# Altium schematic sheet Sheet_1-copy-copy_2026-03-31.schdoc
size 606 x 430 mm
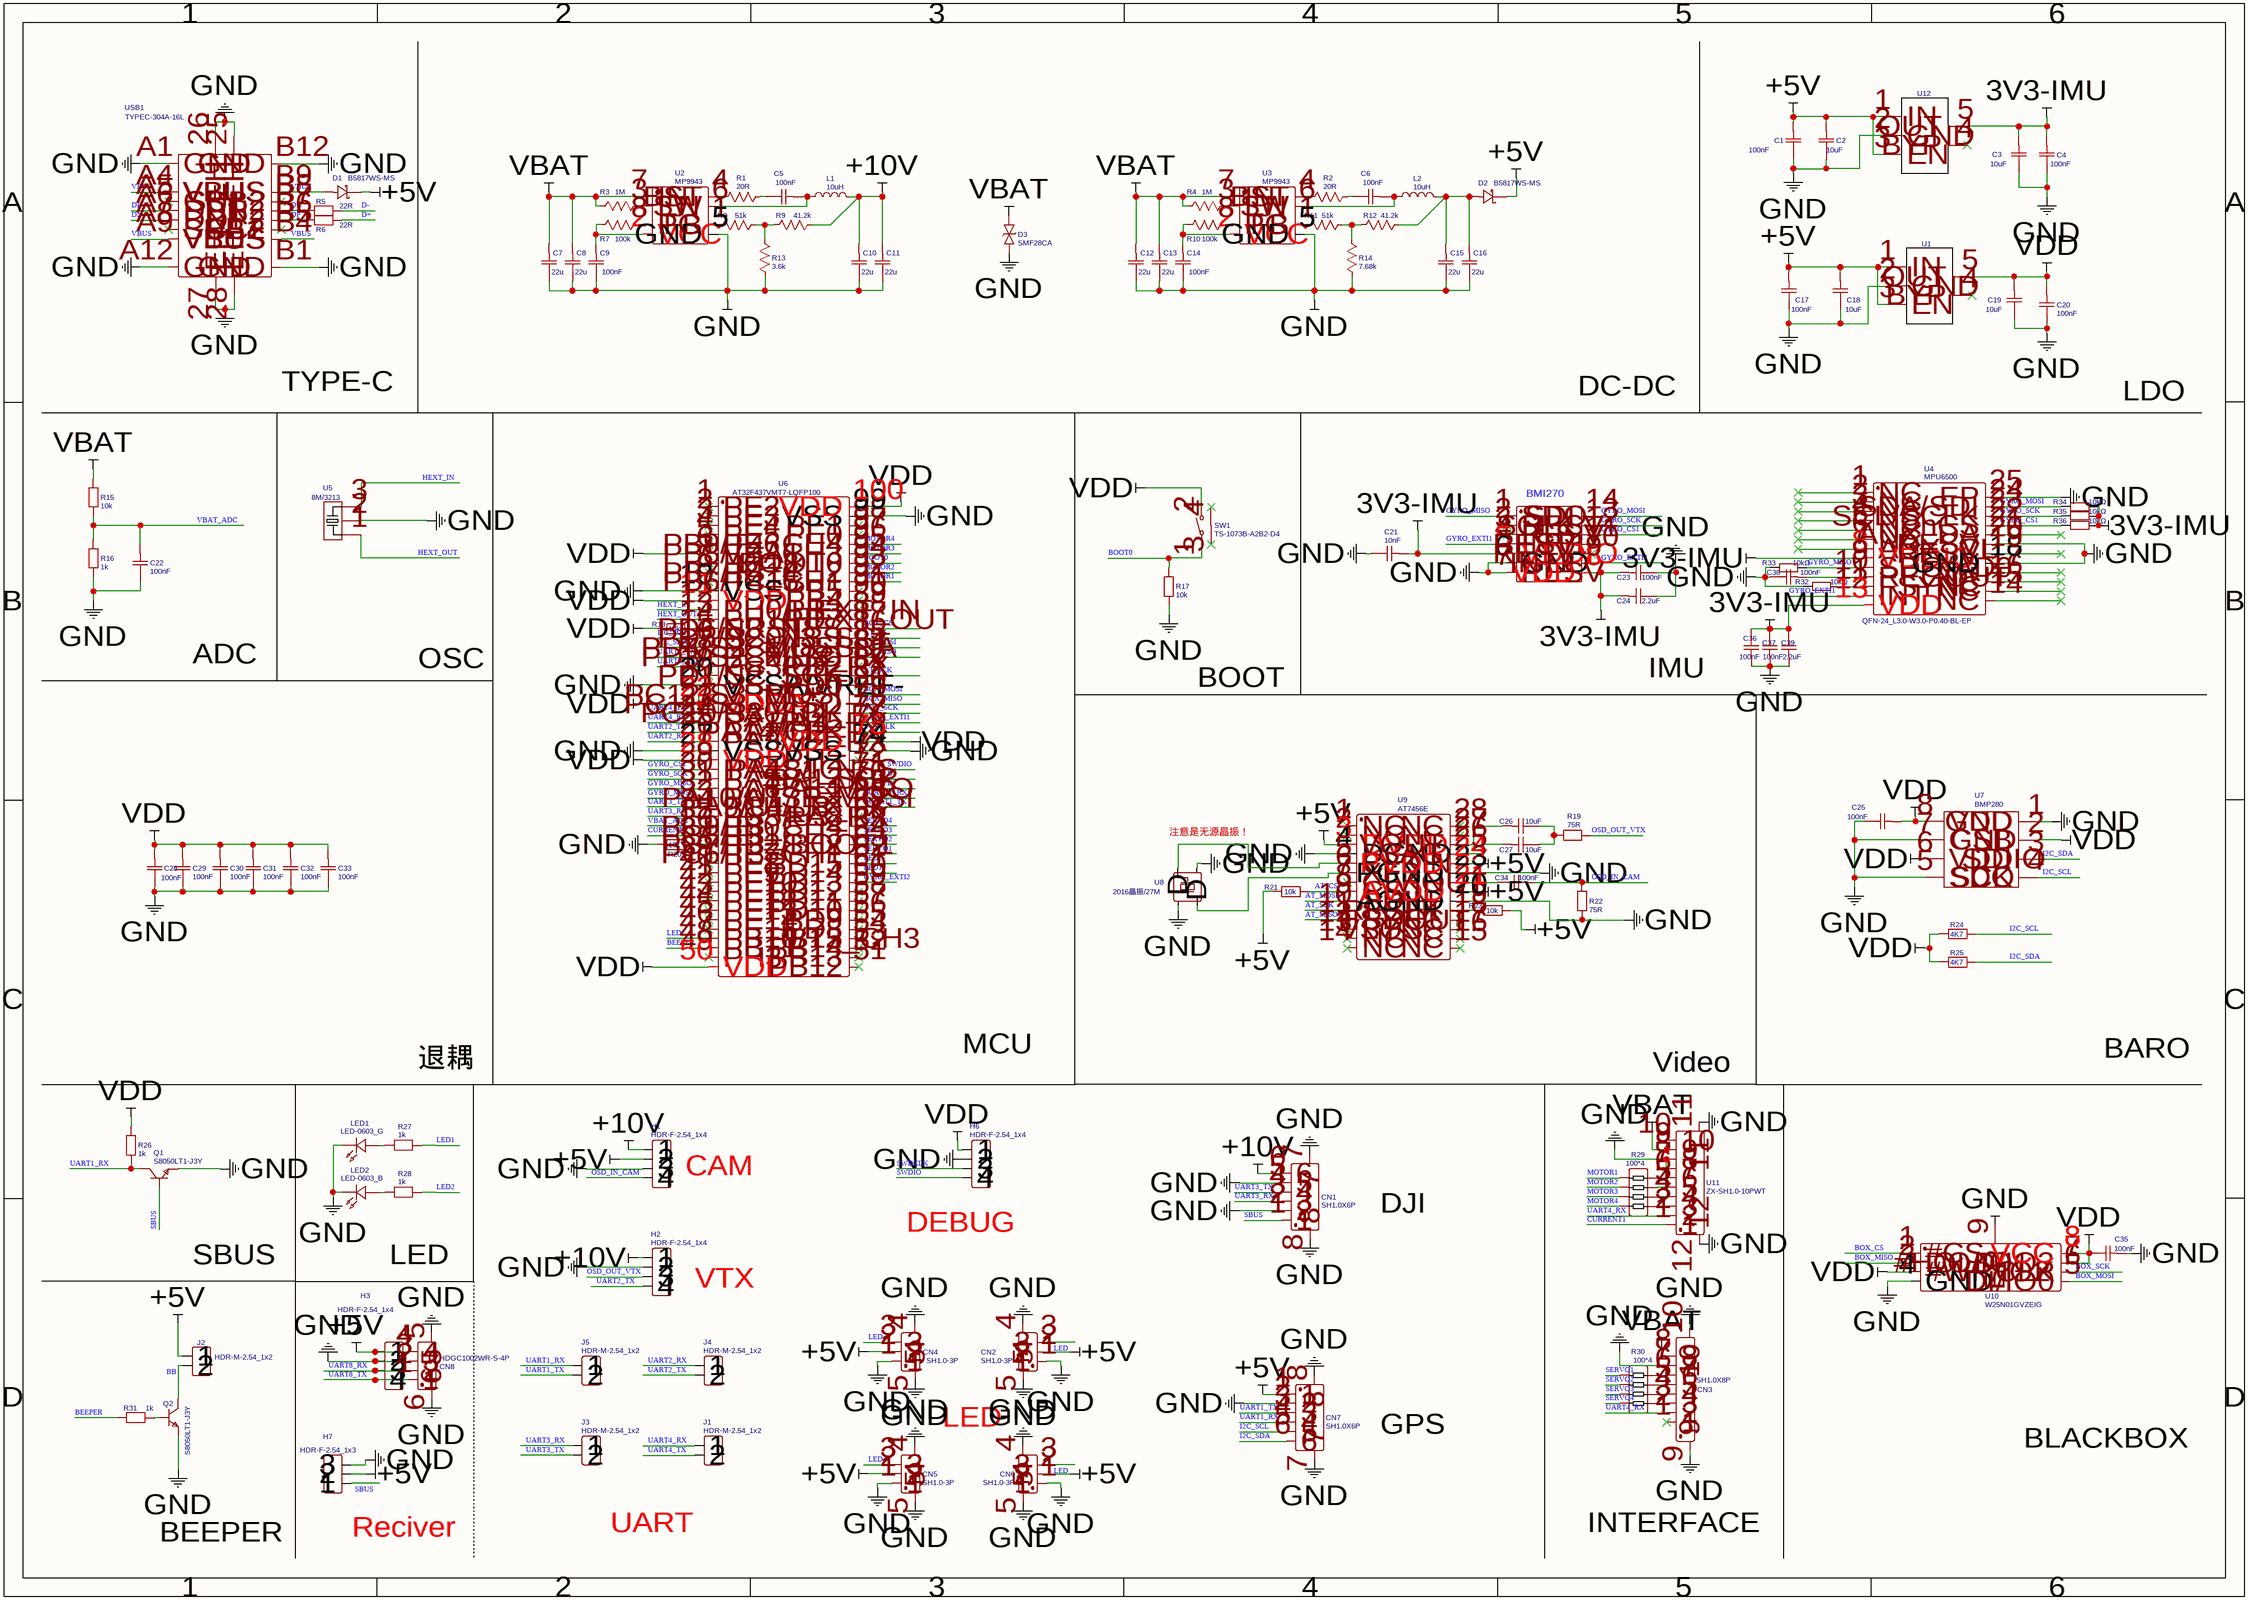
[diagram p0: Sheet_1-copy-copy_2026-03-31.schdoc]

## Parts
C1  100nF  [C0603]
C2  10uF  [C0603]
C3  10uF  [C0603]
C4  100nF  [C0603]
C5  100nF  [C0603]
C6  100nF  [C0603]
C7  22u  [C0805]
C8  22u  [C0805]
C9  100nF  [C0603]
C10  22u  [C0805]
C11  22u  [C0805]
C12  22u  [C0805]
C13  22u  [C0805]
C14  100nF  [C0603]
C15  22u  [C0805]
C16  22u  [C0805]
C17  100nF  [C0603]
C18  10uF  [C0603]
C19  10uF  [C0603]
C20  100nF  [C0603]
C21  10nF  [C0603]
C22  100nF  [C0603]
C23  100nF  [C0603]
C24  2.2uF  [C0603]
C25  100nF  [C0603]
C26  10uF  [C0603]
C27  10uF  [C0603]
C28  100nF  [C0603]
C29  100nF  [C0603]
C30  100nF  [C0603]
C31  100nF  [C0603]
C32  100nF  [C0603]
C33  100nF  [C0603]
C34  100nF  [C0603]
C35  100nF  [C0603]
C36  100nF  [C0603]
C37  100nF  [C0603]
C38  100nF  [C0603]
C39  2.2uF  [C0603]
CN1  SH1.0X6P  [CONN-SMD_6P-P1.00_MEGASTAR_ZX-SH1.0-6PWT]
CN2  SH1.0-3P  [CONN-SMD_3P-P1.00_HDGC_HDGC1002WR-S-3P]
CN3  SH1.0X8P  [CONN-SMD_8P-P1.00_WAFER-SH1.0-8PWB]
CN4  SH1.0-3P  [CONN-SMD_3P-P1.00_HDGC_HDGC1002WR-S-3P]
CN5  SH1.0-3P  [CONN-SMD_3P-P1.00_HDGC_HDGC1002WR-S-3P]
CN6  SH1.0-3P  [CONN-SMD_3P-P1.00_HDGC_HDGC1002WR-S-3P]
CN7  SH1.0X6P  [CONN-SMD_6P-P1.00_MEGASTAR_ZX-SH1.0-6PWT]
CN8  HDGC1002WR-S-4P  [CONN-SMD_4P-P1.00_HDGC_HDGC1002WR-S-4P]
D1  B5817WS-MS  [SOD-323_L1.7-W1.3-LS2.7-FD]
D2  B5817WS-MS  [SOD-323_L1.7-W1.3-LS2.7-FD]
D3  SMF28CA  [SOD-123_L2.7-W1.8-LS3.7-BI]
H1  HDR-F-2.54_1x4  [HDR-F-2.54_1X4]
H2  HDR-F-2.54_1x4  [HDR-F-2.54_1X4]
H3  HDR-F-2.54_1x4  [HDR-F-2.54_1X4]
H6  HDR-F-2.54_1x4  [HDR-F-2.54_1X4]
H7  HDR-F-2.54_1x3  [HDR-F-2.54_1X3]
J1  HDR-M-2.54_1x2  [HDR-M-2.54_1X2]
J2  HDR-M-2.54_1x2  [HDR-M-2.54_1X2]
J3  HDR-M-2.54_1x2  [HDR-M-2.54_1X2]
J4  HDR-M-2.54_1x2  [HDR-M-2.54_1X2]
J5  HDR-M-2.54_1x2  [HDR-M-2.54_1X2]
L1  10uH  [IND-SMD_L4.4-W4.0_PHC0420]
L2  10uH  [IND-SMD_L4.4-W4.0_PHC0420]
LED1  LED-0603_G  [LED0603_GREEN]
LED2  LED-0603_B  [LED0603_BLUE]
Q1  S8050LT1-J3Y  [SOT-23_L2.9-W1.3-P1.90-LS2.4-BR]
Q2  S8050LT1-J3Y  [SOT-23_L2.9-W1.3-P1.90-LS2.4-BR]
R1  20R  [R0603]
R2  20R  [R0603]
R3  1M  [R0603]
R4  1M  [R0603]
R5  22R  [R0603]
R6  22R  [R0603]
R7  100k  [R0603]
R8  51k  [R0603]
R9  41.2k  [R0603]
R10  100k  [R0603]
R11  51k  [R0603]
R12  41.2k  [R0603]
R13  3.6k  [R0603]
R14  7.68k  [R0603]
R15  10k  [R0603]
R16  1k  [R0603]
R17  10k  [R0603]
R18  10k  [R0603]
R19  75R  [R0603]
R20  10k  [R0603]
R21  10k  [R0603]
R22  75R  [R0603]
R23  10k  [R0603]
R24  4K7  [R0603]
R25  4K7  [R0603]
R26  1k  [R0603]
R27  1k  [R0603]
R28  1k  [R0603]
R29  100*4  [RES-ARRAY-SMD_0402-8P-L2.0-W1.0-BL]
R30  100*4  [RES-ARRAY-SMD_0402-8P-L2.0-W1.0-BL]
R31  1k  [R0603]
R32  10kΩ  [R0402]
R33  10kΩ  [R0402]
R34  10kΩ  [R0402]
R35  10kΩ  [R0402]
R36  10kΩ  [R0402]
SDO1  BMI270  [LGA-14_L3.0-W2.5-P0.50-TL]  (value not drawn)
SW1  TS-1073B-A2B2-D4  [KEY-SMD_TS-1073B-A2B2-D4]
U1  SPX3819M5-L-3-3/TR  [SOT-23-5_L3.0-W1.7-P0.95-LS2.8-BL]  (value not drawn)
U2  MP9943  [QFN-8-3X3]
U3  MP9943  [QFN-8-3X3]
U4  MPU6500  [QFN-24_L3.0-W3.0-P0.40-BL-EP]
U5  8M/3213  [X3213]
U6  AT32F437VMT7-LQFP100  [LQFP-100_L14.0-W14.0-P0.50-LS16.0-TL]
U7  BMP280  [SENSOR-TH_BMP280-BL]
U8  2016晶振/27M  [2016晶振]
U9  AT7456E  [TSSOP-28_L9.7-W4.4-P0.65-LS6.4-BL-EP5.5]
U10  W25N01GVZEIG  [WSON-8_L8.0-W6.10-P1.27-EP]
U11  ZX-SH1.0-10PWT  [CONN-SMD_10P-P1.00_ZX-SH1.0-10PWT]
U12  SPX3819M5-L-3-3/TR  [SOT-23-5_L3.0-W1.7-P0.95-LS2.8-BL]  (value not drawn)
USB1  TYPEC-304A-16L  [USB-C-SMD_XUNPU_TYPEC-304A-ACP16L]

## Nets
3V3-IMU: C3.2 C4.2 C21.2 C23.2 C24.2 C36.1 C37.1 C39.1 R34.2 R35.2 R36.2 SDO1.5(VDDIO) SDO1.8(VDD) U4.8(VDDIO) U4.13(VDD) U12.5(OUT)
+5V: C1.2 C2.2 C17.2 C18.2 CN2.2 CN4.2 CN5.2 CN6.2 CN7.1 CN8.4 D1.2(K) D2.2(K) H1.2 H3.1 H7.2 J2.1 R21.1 R23.2 U1.1(IN) U1.3(EN) U9.3(DVDD) U9.21(AVDD) U9.24(PVDD) U12.1(IN) U12.3(EN)
+10V: C10.2 C11.2 CN1.6 H1.1 H2.1 L1.2 R9.2
GND: C1.1 C2.1 C3.1 C4.1 C7.1 C8.1 C9.1 C10.1 C11.1 C12.1 C13.1 C14.1 C15.1 C16.1 C17.1 C18.1 C19.1 C20.1 C21.1 C22.1 C23.1 C24.1 C25.1 C28.1 C29.1 C30.1 C31.1 C32.1 C33.1 C35.2 C36.2 C37.2 C38.1 C39.2 CN1.2 CN1.5 CN1.7 CN1.8 CN2.1 CN2.4 CN2.5 CN3.7 CN3.9 CN3.10 CN4.1 CN4.4 CN4.5 CN5.1 CN5.4 CN5.5 CN6.1 CN6.4 CN6.5 CN7.2 CN7.7 CN7.8 CN8.3 CN8.5 CN8.6 D3.2 H1.3 H2.2 H3.2 H6.2 H7.3 LED1.2 LED2.2 Q1.2 Q2.2 R13.1 R14.1 R16.1 R17.2 R20.1 R22.1 R32.1 R33.1 SDO1.6(GND) SDO1.7(RESV) U1.2(GND) U2.5(GND) U3.5(GND) U4.18(GND) U4.20(RESV) U4.25(EP) U5.2 U6.10(VSS) U6.20(VSSA/VREF-) U6.27(VSS) U6.74(VSS) U6.99(VSS) U7.1(GND) U7.5(SDO) U7.7(GND) U8.2(D) U8.4(D) U9.4(DGND) U9.20(AGND) U9.23(PGND) U10.4(GND) U10.9(EP) U11.7 U11.8 U11.11 U11.12 U12.2(GND) USB1.25(EH) USB1.26(EH) USB1.27(EH) USB1.28(EH) USB1.A1(GND) USB1.A12(GND) USB1.B1(GND) USB1.B12(GND)
VBAT: C7.2 C8.2 C12.2 C13.2 CN3.8 D3.1 R3.2 R4.2 R15.2 U2.7(IN) U3.7(IN) U11.9 U11.10
VDD: C19.2 C20.2 C25.2 C28.2 C29.2 C30.2 C31.2 C32.2 C33.2 C35.1 H6.1 R18.2 R24.2 R25.2 R26.2 SW1.2 U1.5(OUT) U6.6(VBAT) U6.11(VDD) U6.21(VREF+) U6.22(VDDA) U6.28(VDD) U6.50(VDD) U6.75(VDD) U6.100(VDD) U7.2(CSB) U7.6(VDDIO) U7.8(VDD) U10.3(#WP/IO2) U10.7(#HOLD/IO3) U10.8(VCC)
AT_CS: R21.2 U6.86(PD5/S2_NSS) U9.8(CS)
AT_MISO: U6.84(PD3/S2_MISO) U9.11(SDOUT)
AT_MOSI: U6.85(PD4/S2_MOSI) U9.9(SDIN)
AT_SCK: U6.82(PD1/S2_SCK) U9.10(SCLK)
BB: J2.2 Q2.3
BEEPER: R31.1 U6.48(PB11)
BOOT0: R17.1 SW1.1 U6.94(BOOT0)
BOX_CS: U6.87(PD6/S3_NSS) U10.1(#CS)
BOX_MISO: U6.79(PC11/S3_MISO) U10.2(DO/IO1)
BOX_MOSI: U6.80(PC12/S3_MOSI) U10.5(DI/IO0)
BOX_SCK: U6.78(PC10/S3_SCK) U10.6(CLK)
CURRENT1: U6.36(PB1) U11.1
D+: R6.2 U6.71(PA12)
D-: R5.2 U6.70(PA11)
DN: R5.1 USB1.A7(DN1) USB1.B7(DN2)
DP: R6.1 USB1.A6(DP1) USB1.B6(DP2)
GYRO_CS1: R36.1 SDO1.12(CS) U4.22(nCS) U6.29(PA~{4}S1_NSS)
GYRO_EXTI1: SDO1.4(INT1) U4.12(INT) U6.77(PA15)
GYRO_EXTI2: SDO1.9(INT2) U6.60(PD13)
GYRO_MISO: R33.2 SDO1.1(SDO) U4.9(SDO/AD0) U6.31(PA~{6}S1_MISO)
GYRO_MOSI: R34.1 SDO1.14(SDI) U4.24(SDA/SDI) U6.32(PA~{7}S1_MOSI)
GYRO_SCK: R35.1 SDO1.13(SCLK) U4.23(SCL/SCLK) U6.30(PA~{5}S1_SCK)
HEXT_IN: U5.3 U6.12(PH0/HEXT_IN)
HEXT_OUT: U5.1 U6.13(PH1/HEXT_OUT)
I2C_SCL: CN7.5 R24.1 U6.15(PC0/I3_SCL) U7.4(SCK)
I2C_SDA: CN7.6 R25.1 U6.16(PC1/I3_SDA) U7.3(SDI)
LED: CN2.3 CN4.3 CN5.3 CN6.3 U6.47(PB10/T2_CH3)
LED1: R27.2 U6.61(PD14)
LED2: R28.2 U6.62(PD15)
MOTOR1: R29.4 U6.92(PB6/T4_CH1)
MOTOR2: R29.3 U6.93(PB7/T4_CH2)
MOTOR3: R29.2 U6.95(PB8/T4_CH3)
MOTOR4: R29.1 U6.96(PB9/T4_CH4)
OSD_IN_CAM: C34.2 H1.4 R22.2
OSD_OUT_VTX: H2.3 R19.2
SBUS: CN1.1 H7.1 Q1.1
SERVO1: R30.4 U6.63(PC6/T3_CH1)
SERVO2: R30.3 U6.64(PC7/T3_CH2)
SERVO3: R30.2 U6.65(PC8/T3_CH3)
SERVO4: R30.1 U6.66(PC9/T3_CH4)
SWDCLK: H6.3 U6.76(PA14/CLK)
SWDIO: H6.4 U6.72(PA13/IO)
UART1_RX: CN7.4 J5.1 Q1.3 R26.1 U6.69(PA10/U1_RX)
UART1_TX: CN7.3 J5.2 U6.68(PA9/U1_TX)
UART2_RX: J4.1 U6.26(PA3/U2_RX)
UART2_TX: H2.4 J4.2 U6.25(PA2/U2_TX)
UART3_RX: CN1.3 J3.1 U6.34(PC5/U3_RX)
UART3_TX: CN1.4 J3.2 U6.33(PC4/U3_TX)
UART4_RX: CN3.2 J1.1 U6.24(PA1/U4_RX) U11.2
UART4_TX: J1.2 U6.23(PA0/U4_TX)
UART8_RX: CN8.2 H3.3 U6.18(PC3/U8_RX)
UART8_TX: CN8.1 H3.4 U6.17(PC2/U8_TX)
VBAT_ADC: C22.2 R15.1 R16.2 U6.35(PB0)
VBUS: D1.1(A) USB1.A4(VBUS) USB1.A9(VBUS) USB1.B4(VBUS) USB1.B9(VBUS)
NetC5_1: C5.1 R1.2
NetC5_2: C5.2 L1.1 U2.6(SW)
NetC6_1: C6.1 R2.2
NetC6_2: C6.2 L2.1 U3.6(SW)
NetC9_2: C9.2 R7.1 U2.2(VCC)
NetC14_2: C14.2 R10.1 U3.2(VCC)
NetC15_2: C15.2 C16.2 D2.1(A) L2.2 R12.2
NetC26_1: C26.1 C27.1 R19.1
NetC26_2: C26.2 U9.26(VOUT)
NetC27_2: C27.2 U9.25(SAG)
NetC34_1: C34.1 U9.22(VIN)
NetC38_2: C38.2 U4.10(REGOUT)
NetCN3_3: CN3.3 R30.8
NetCN3_4: CN3.4 R30.7
NetCN3_5: CN3.5 R30.6
NetCN3_6: CN3.6 R30.5
NetLED1_1: LED1.1 R27.1
NetLED2_1: LED2.1 R28.1
NetQ2_1: Q2.1 R31.2
NetR1_1: R1.1 U2.4(BST)
NetR2_1: R2.1 U3.4(BST)
NetR3_1: R3.1 U2.3(EN)
NetR4_1: R4.1 U3.3(EN)
NetR7_2: R7.2 U2.8(PG)
NetR8_1: R8.1 U2.1(FB)
NetR8_2: R8.2 R9.1 R13.2
NetR10_2: R10.2 U3.8(PG)
NetR11_1: R11.1 U3.1(FB)
NetR11_2: R11.2 R12.1 R14.2
NetR18_1: R18.1 U6.14(NRST)
NetR20_2: R20.2 U6.37(PB2/BOOT1)
NetR23_1: R23.1 U9.19(RESET)
NetR29_5: R29.5 U11.6
NetR29_6: R29.6 U11.5
NetR29_7: R29.7 U11.4
NetR29_8: R29.8 U11.3
NetR32_2: R32.2 U4.11(FSYNC)
NetU8_1: U8.1(OSC1) U9.5(CLKIN)
NetU8_3: U8.3(OSC2) U9.6(XFB)

Not connected (* = marked no-connect by the designer): CN3 1*; SDO1 2(RESV)* 3(RESV)* 10(RESV)* 11(RESV)*; SW1 3* 4*; U1 4(BYP)*; U4 1(NC)* 2(NC)* 3(NC)* 4(NC)* 5(NC)* 6(NC)* 7(AUX_CL)* 14(NC)* 15(NC)* 16(NC)* 17(NC)* 19(RESV)* 21(AUX_DA)*; U6 1(PE2)* 2(PE3)* 3(PE4)* 4(PE5)* 5(PE6)* 7(PC13)* 8(PC14)* 9(PC15)* 19(NC)* 38(PE7)* 39(PE8)* 40(PE9)* 41(PE10)* 42(PE11)* 43(PE12)* 44(PE13)* 45(PE14)* 46(PE15)* 49(PH3)* 51(PB12)* 52(PB13)* 53(PB14)* 54(PB15)* 55(PD8)* 56(PD9)* 57(PD10)* 58(PD11)* 59(PD12)* 67(PA8)* 73(PH2)* 81(PD0)* 83(PD2)* 88(PD7)* 89(PB3)* 90(PB4)* 91(PB5)* 97(PE0)* 98(PE1)*; U9 1(NC)* 2(NC)* 7(CLKOUT)* 12(LOS)* 13(NC)* 14(NC)* 15(NC)* 16(NC)* 17(VSYNC)* 18(HSYNC)* 27(NC)* 28(NC)*; U12 4(BYP)*; USB1 A5(CC1)* A8(SUB1)* B5(CC2)* B8(SUB2)*

## Notes on the sheet
- TYPE-C
- DC-DC
- LDO
- (near SDO1) BMI270
- ADC
- OSC
- BOOT
- IMU
- (near U8) 注意是无源晶振！
- 退耦
- MCU
- Video
- BARO
- (near H1) CAM
- (near H6) DEBUG
- DJI
- SBUS
- LED
- VTX
- GPS
- BLACKBOX
- BEEPER
- (near H7) Reciver
- UART
- INTERFACE
- (in symbol MPU6500) QFN-24_L3.0-W3.0-P0.40-BL-EP

## Library data of the parts
C1 C4-C6 C9 C14 C17 C20 C22 C23 C25 C28-C38 = 100nF: nameAlias: Value(F); Contributor: LCEDA_Lib; spicePre: C
  C1 C4 C17: spiceSymbolName: C_0603_US
  C5 C6 C9 C14: spiceSymbolName: C_0201_US
  C20 C22 C23 C25 C28-C38: spiceSymbolName: C_0402_US
C2 C3 C18 C19 C26 C27 = 10uF: nameAlias: Value(F); Contributor: LCEDA_Lib; spicePre: C
  C2 C3 C19 C26 C27: spiceSymbolName: C_0603_US
  C18: spiceSymbolName: C_0402_US
C7 C8 C10-C13 C15 C16 = 22u: nameAlias: Value(F); Contributor: LCEDA_Lib; spicePre: C; spiceSymbolName: C_0201_US
C21 = 10nF: nameAlias: Value(F); Contributor: LCEDA_Lib; spicePre: C; spiceSymbolName: C_0402_US
C24 C39 = 2.2uF: nameAlias: Value(F); Contributor: LCEDA_Lib; spicePre: C; spiceSymbolName: C_0402_US
CN1 CN7 = SH1.0X6P: Manufacturer: Megastar(兆星); Manufacturer Part: ZX-SH1.0-6PWT; Contributor: lcsc; Supplier: LCSC; Supplier Part: C7430448; JLCPCB Part Class: Extended Part; link: https://so.szlcsc.com/global.html?k=C7430448&ref=editor; spicePre: U; spiceSymbolName: ZX-SH1.0-6PWT
CN2 CN4-CN6 = SH1.0-3P: Manufacturer: HDGC(华德共创); Manufacturer Part: HDGC1002WR-S-3P; Contributor: LCSC; Supplier: LCSC; Supplier Part: C2936213; JLCPCB Part Class: Extended Part; spicePre: C; spiceSymbolName: HDGC1002WR-S-3P
CN3 = SH1.0X8P: Manufacturer: null; Manufacturer Part: WAFER_SMT_1.0X8; Contributor: lcsc; Supplier: LCSC; Supplier Part: C9900021939; JLCPCB Part Class: Extended Part; spicePre: C; spiceSymbolName: WAFER_SMT_1.0X8
CN8 = HDGC1002WR-S-4P: Manufacturer: HDGC(华德共创); Contributor: LCSC; Supplier: LCSC; Supplier Part: C2936214; Manufacturer Part: HDGC1002WR-S-4P; JLCPCB Part Class: Extended Part; spicePre: C; spiceSymbolName: HDGC1002WR-S-4P
D1 D2 = B5817WS-MS: Manufacturer: MSKSEMI(美森科); Contributor: LCSC; Supplier: LCSC; Supplier Part: C2836388; Manufacturer Part: B5817WS-MS; JLCPCB Part Class: Extended Part; spicePre: D; spiceSymbolName: B5817WS-MS
D3 = SMF28CA: Manufacturer: AnBon(安邦); Contributor: LCSC; Supplier: LCSC; Supplier Part: C435496; Manufacturer Part: SMF28CA; JLCPCB Part Class: Extended Part; link: https://so.szlcsc.com/global.html?k=C435496&ref=editor; spicePre: D; spiceSymbolName: SMF28CA_C435496
H1-H3 H6 = HDR-F-2.54_1x4: Contributor: LCEDA_Lib; Supplier Part: C225501; Supplier: LCSC; spicePre: H; spiceSymbolName: HDR-F-2.54_1x4
H7 = HDR-F-2.54_1x3: Contributor: LCEDA_Lib; Supplier Part: C146690; Supplier: LCSC; spicePre: H; spiceSymbolName: HDR-F-2.54_1x3
J1-J5 = HDR-M-2.54_1x2: Contributor: LCEDA_Lib; Supplier Part: C124375; Supplier: LCSC; spicePre: J; spiceSymbolName: HDR-M-2.54_1x2
L1 L2 = 10uH: Manufacturer: EMTEK; Manufacturer Part: PHC0420-100M-T; nameAlias: Inductance; Contributor: LCSC; Supplier: LCSC; Supplier Part: C251694; spicePre: L; spiceSymbolName: PHC0420-100M-T
LED1 = LED-0603_G: Manufacturer: EVERLIGHT(台湾亿光); Manufacturer Part: 19-217/GHC-YR1S2/3T; Contributor: LCEDA_Lib; Supplier Part: C72043; Supplier: LCSC; spicePre: L; spiceSymbolName: LED-0603_G
LED2 = LED-0603_B: Manufacturer: EVERLIGHT(台湾亿光); Manufacturer Part: 19-217/BHC-ZL1M2RY/3T; Contributor: LCEDA_01; Supplier Part: C72041; Supplier: LCSC; spicePre: L; spiceSymbolName: LED-0603_B
Q1 Q2 = S8050LT1-J3Y: Manufacturer: FH(风华); Contributor: lcsc; Supplier: LCSC; Supplier Part: C2962087; Manufacturer Part: S8050LT1-J3Y; link: https://atta.szlcsc.com/upload/public/pdf/source/20220411/740B3F4857AB400E9826209E74F1EDA4.pdf; spicePre: Q; spiceSymbolName: S8050LT1-J3Y
R1 R2 = 20R: nameAlias: Value(Ω); Contributor: LCEDA_Lib; spicePre: R; spiceSymbolName: R_0201_US
R3 R4 = 1M: nameAlias: Value(Ω); Contributor: LCEDA_Lib; spicePre: R; spiceSymbolName: R_0201_US
R5 R6 = 22R: nameAlias: Value(Ω); Contributor: LCEDA_Lib; spicePre: R; spiceSymbolName: R_0402_EU
R7 R10 = 100k: nameAlias: Value(Ω); Contributor: LCEDA_Lib; spicePre: R; spiceSymbolName: R_0201_US
R8 R11 = 51k: nameAlias: Value(Ω); Contributor: LCEDA_Lib; spicePre: R; spiceSymbolName: R_0201_US
R9 R12 = 41.2k: nameAlias: Value(Ω); Contributor: LCEDA_Lib; spicePre: R; spiceSymbolName: R_0201_US
R13 = 3.6k: nameAlias: Value(Ω); Contributor: LCEDA_Lib; spicePre: R; spiceSymbolName: R_0201_US
R14 = 7.68k: nameAlias: Value(Ω); Contributor: LCEDA_Lib; spicePre: R; spiceSymbolName: R_0201_US
R15 R17 R18 R20 R21 R23 = 10k: nameAlias: Value(Ω); Contributor: LCEDA_Lib; spicePre: R
  R15 R17 R18 R20: spiceSymbolName: R_0603_EU
  R21 R23: spiceSymbolName: R_0402_EU
R16 R26-R28 R31 = 1k: nameAlias: Value(Ω); Contributor: LCEDA_Lib; spicePre: R
  R16 R27 R28: spiceSymbolName: R_0603_EU
  R26 R31: spiceSymbolName: R_0402_EU
R19 R22 = 75R: nameAlias: Value(Ω); Contributor: LCEDA_Lib; spicePre: R; spiceSymbolName: R_0805_EU
R24 R25 = 4K7: nameAlias: Value(Ω); Contributor: LCEDA_Lib; spicePre: R; spiceSymbolName: R_0402_EU
R29 R30 = 100*4: Manufacturer: UNI-ROYAL(厚声); Manufacturer Part: 4D02WGF1002TCE; nameAlias: Resistance; Contributor: LCSC; Supplier: LCSC; Supplier Part: C414600; spicePre: R; spiceSymbolName: 4D02WGF1002TCE
R32-R36 = 10kΩ: Manufacturer: YAGEO(国巨); Manufacturer Part: RC0402FR-0710KL; nameAlias: Value; Package Display: No; Supplier: LCSC; Supplier Part: C60490; JLCPCB Part Class: Extended Part; spicePre: R; spiceSymbolName: RC0402FR-0710KL
SDO1 = BMI270: Contributor: SPRain; Supplier: InvenSense; link: https://3cfeqx1hf82y3xcoull08ihx-wpengine.netdna-ssl.com/wp-content/uploads/2020/09/DS-000347-ICM-42688-P-v1.3.pdf; spicePre: U; spiceSymbolName: ICM42688-P
SW1 = TS-1073B-A2B2-D4: Manufacturer: Yuandi(元迪); Contributor: LCSC; Supplier: LCSC; Supplier Part: C492942; Manufacturer Part: TS-1073B-A2B2-D4; JLCPCB Part Class: Extended Part; link: https://so.szlcsc.com/global.html?k=C492942&ref=editor; spicePre: S; spiceSymbolName: TS-1073B-A2B2-D4
U1 U12 = SPX3819M5-L-3-3/TR: Manufacturer: MaxLinear(迈凌); Package Display: No; Supplier: LCSC; Manufacturer Part: SPX3819M5-L-3-3/TR; Supplier Part: C9055; JLCPCB Part Class: Extended Part; spicePre: U; spiceSymbolName: SPX3819M5-L-3-3/TR
U2 U3 = MP9943: Contributor: jeasyn; spicePre: U; spiceSymbolName: MP9943
U4 = MPU6500: Manufacturer: TDK InvenSense(应美盛); Package Display: Yes; Supplier: LCSC; Manufacturer Part: MPU-6500; Supplier Part: C50278; JLCPCB Part Class: Extended Part; spicePre: U; spiceSymbolName: MPU6500
U5 = 8M/3213: Contributor: 5_6956; spicePre: U; spiceSymbolName: 3213晶振
U6 = AT32F437VMT7-LQFP100: Manufacturer: ARTERY（雅特力）; Manufacturer Part: AT32F435VMT7; Contributor: lcsc; Supplier: LCSC; Supplier Part: C3029578; link: https://atta.szlcsc.com/upload/public/pdf/source/20220608/9A6D4578C11CEA8ECA586071DFEBC06A.pdf; spicePre: U; spiceSymbolName: AT32F435VGT7
U7 = BMP280: Manufacturer: Bosch; Supplier: LCSC; Manufacturer Part: BMP280; Supplier Part: C83291; JLCPCB Part Class: Extended Part; spicePre: U; spiceSymbolName: BMP280
U8 = 2016晶振/27M: Contributor: jimssa; spicePre: U; spiceSymbolName: 3225晶振
U9 = AT7456E: Manufacturer: ZHONGKEWEI; Supplier: LCSC; Manufacturer Part: AT7456E; Supplier Part: C82351; JLCPCB Part Class: Extended Part; spicePre: U; spiceSymbolName: AT7456E
U10 = W25N01GVZEIG: Manufacturer: Winbond Elec; Contributor: SudoMaker; Supplier: LCSC; Supplier Part: C88868; Manufacturer Part: W25N01GVZEIG; JLCPCB Part Class: Extended Part; spicePre: U; spiceSymbolName: W25N01GVZEIG NoHole
U11 = ZX-SH1.0-10PWT: Manufacturer: Megastar(兆星); Contributor: lcsc; Supplier: LCSC; Supplier Part: C19272377; Manufacturer Part: ZX-SH1.0-10PWT; spicePre: U; spiceSymbolName: ZX-SH1.0-10PWT
USB1 = TYPEC-304A-16L: Manufacturer: XUNPU(讯普); Manufacturer Part: TYPEC-304A-ACP16L; Contributor: LCSC; Supplier: LCSC; Supplier Part: C2909609; JLCPCB Part Class: Extended Part; spicePre: U; spiceSymbolName: TYPEC-304A-ACP16L